# Altium project Line_Follower5.1.PrjPCB
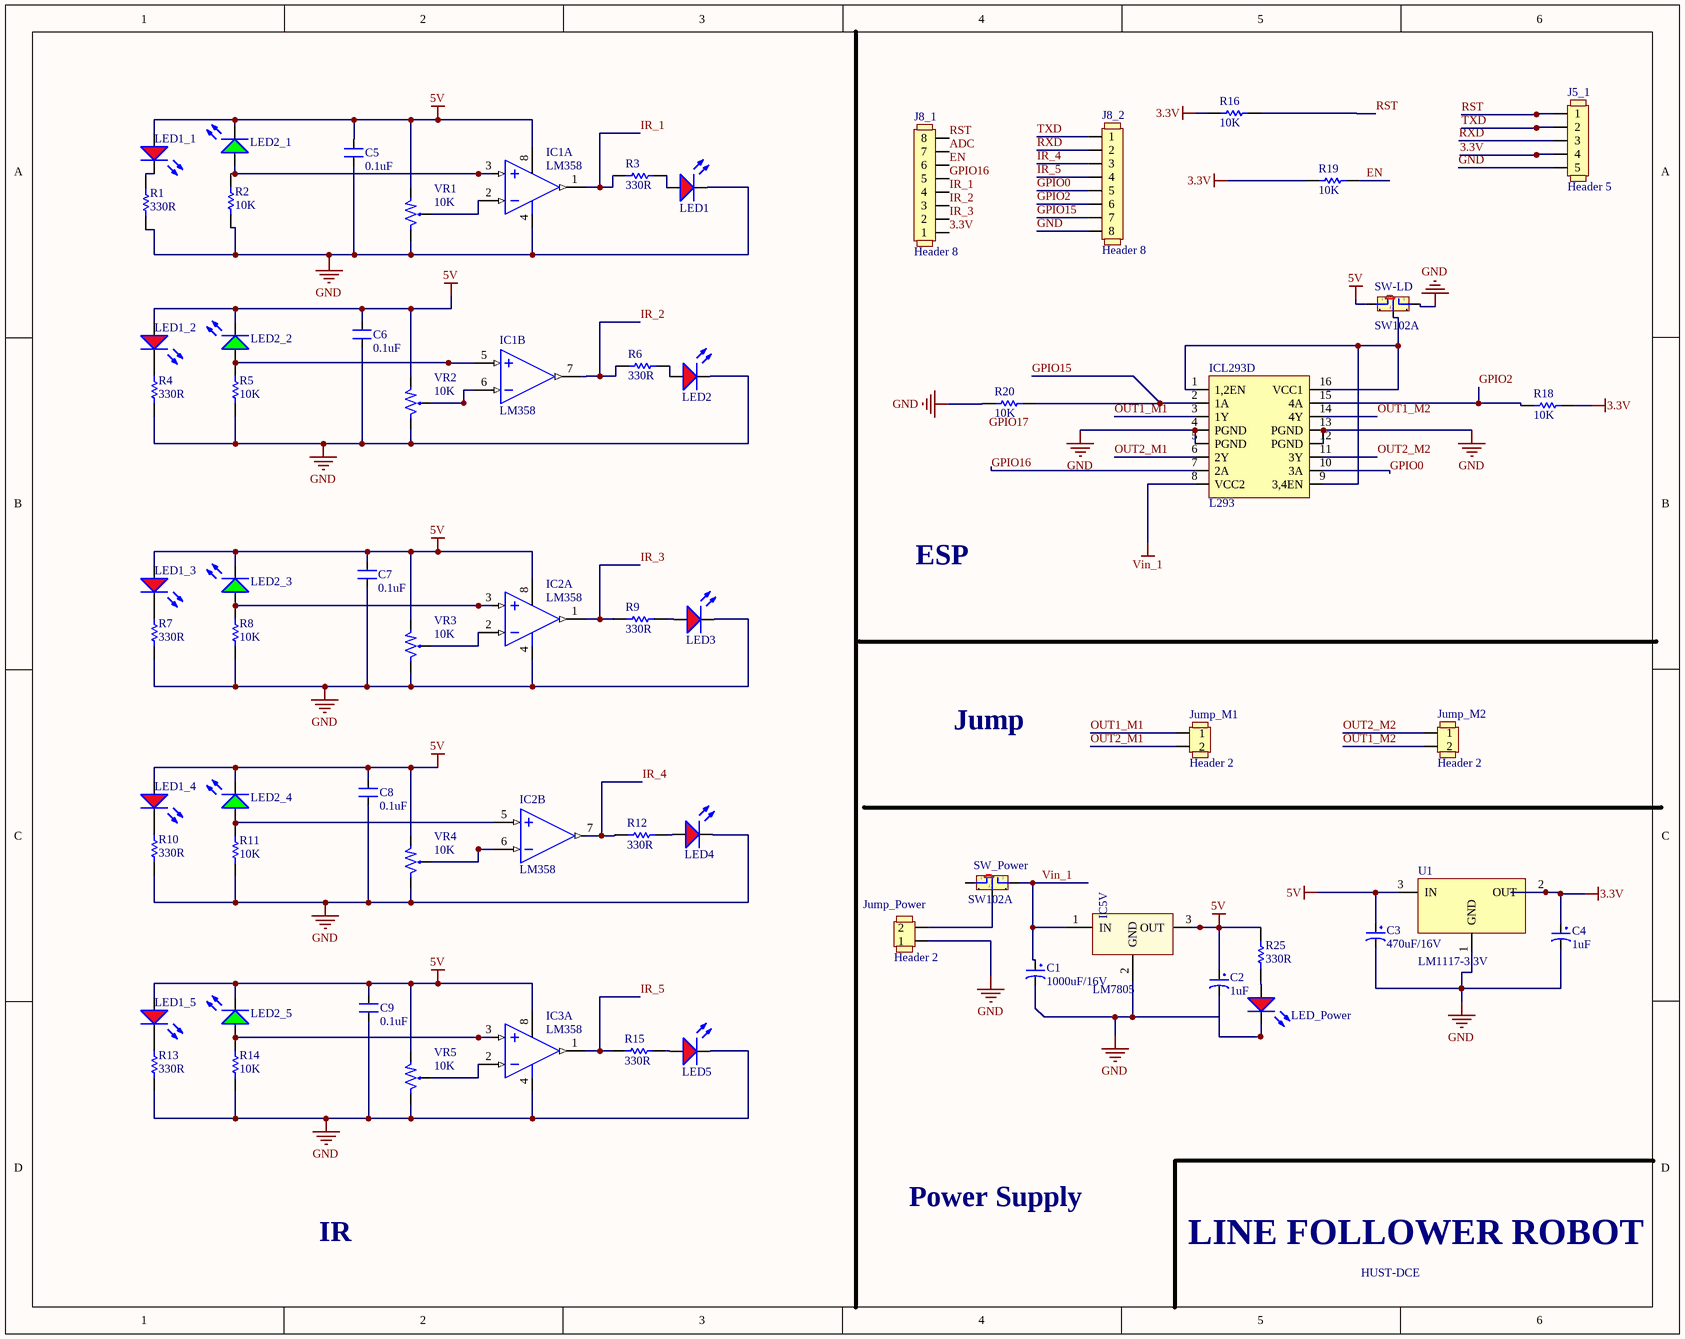
[diagram p0: Line_Follower5.1.SchDoc]
3 sheets, 78 parts. Net scope: global (net labels, ports and power ports of the same name join across sheets).
Board file: Line_Follower5.1.PcbDoc
Sheets:
  Line_Follower5.1.SchDoc
  ESP8266_base5.1.SchDoc
  ESP8266_base5.1-2.SchDoc

## Sheet Line_Follower5.1.SchDoc
size 314 x 250 mm

### Parts
(Parts that share a designator on the sheet are numbered #1, #2 ... from top to bottom, then left to right.)
C1  1000uF/16V  [CP1.5/3.4]
C2  1uF  [CAP_xUF_50V_TH_5x11]
C3  470uF/16V  [CP1.5/3.4]
C4  1uF  [CAP_xUF_50V_TH_5x11]
C5  0.1uF  [CAP_10x_TH]
C6  0.1uF  [CAP_10x_TH]
C7  0.1uF  [CAP_10x_TH]
C8  0.1uF  [CAP_10x_TH]
C9  0.1uF  [CAP_10x_TH]
IC1  LM358  [DIP8/W0.3]  (parts A,B of 2)
IC2  LM358  [DIP8/W0.3]  (parts A,B of 2)
IC3  LM358  [DIP8/W0.3]  (part A of 2)
IC5V  LM7805  [QTO-220]
ICL293D  L293  [L293]
J5_1  Header 5  [HEADER x5(2)]
J8_1  Header 8  [HEADER FEMALE x8]
J8_2  Header 8  [HEADER FEMALE x8]
Jump_M1  Header 2  [HEADER x2 (2)]
Jump_M2  Header 2  [HEADER x2 (2)]
Jump_Power  Header 2  [KF128 2P 5.08mm]
LED1  LED_RED  [LED3R3mm]  (value not drawn)
LED1_1  LED_RED  [LED5R5mm]  (value not drawn)
LED1_2  LED_RED  [LED5R5mm]  (value not drawn)
LED1_3  LED_RED  [LED5R5mm]  (value not drawn)
LED1_4  LED_RED  [LED5R5mm]  (value not drawn)
LED1_5  LED_RED  [LED5R5mm]  (value not drawn)
LED2  LED_RED  [LED3R3mm]  (value not drawn)
LED2_1  LED_GREEN  [LED3G3mm]  (value not drawn)
LED2_2  LED_GREEN  [LED3G3mm]  (value not drawn)
LED2_3  LED_GREEN  [LED3G3mm]  (value not drawn)
LED2_4  LED_GREEN  [LED3G3mm]  (value not drawn)
LED2_5  LED_GREEN  [LED3G3mm]  (value not drawn)
LED3  LED_RED  [LED3R3mm]  (value not drawn)
LED4  LED_RED  [LED3R3mm]  (value not drawn)
LED5  LED_RED  [LED3R3mm]  (value not drawn)
LED_Power  LED_RED  [LED3R3mm]  (value not drawn)
R1#1  330R  [CR25S]
R2#1  10K  [CR25S]
R3  330R  [CR25S]
R4  330R  [CR25S]
R5  10K  [CR25S]
R6  330R  [CR25S]
R7  330R  [CR25S]
R8  10K  [CR25S]
R9  330R  [CR25S]
R10  330R  [CR25S]
R11  10K  [CR25S]
R12  330R  [CR25S]
R13  330R  [CR25S]
R14  10K  [CR25S]
R15  330R  [CR25S]
R16  10K  [CR25S]
R18  10K  [CR25S]
R19  10K  [CR25S]
R20  10K  [CR25S]
R25  330R  [CR25S]
SW-LD  SW102A  [SW102]
SW_Power  SW102A  [SW102]
U1  LM1117-3.3V  [TO220-123]
VR1  10K  [Trimmer 3262]
VR2  10K  [Trimmer 3262]
VR3  10K  [Trimmer 3262]
VR4  10K  [Trimmer 3262]
VR5  10K  [Trimmer 3262]

### Nets
3.3V: C4.1 J5_1.4 J8_1.1 R16.1 R18.2 R19.1 U1.2(OUT)
5V: C2.1 C3.1 C5.2 C6.2 C7.2 C8.2 C9.2 IC1.8(+V) IC2.8(+V) IC3.8(+V) IC5V.3(OUT) LED1_1.1(A) LED1_2.1(A) LED1_3.1(A) LED1_4.1(A) LED1_5.1(A) LED2_1.2(K) LED2_2.2(K) LED2_3.2(K) LED2_4.2(K) LED2_5.2(K) R25.1 SW-LD.1 U1.3(IN) VR1.1 VR2.1 VR3.1 VR4.1 VR5.1
GND: C1.2 C2.2 C3.2 C4.2 C5.1 C6.1 C7.1 C8.1 C9.1 IC1.4(-V) IC2.4(-V) IC3.4(-V) IC5V.2(GND) ICL293D.4(PGND) ICL293D.5(PGND) ICL293D.12(PGND) ICL293D.13(PGND) J5_1.5 J8_2.8 Jump_Power.1 LED1.2(K) LED2.2(K) LED3.2(K) LED4.2(K) LED5.2(K) LED_Power.2(K) R1#1.2 R2#1.2 R4.2 R5.2 R7.2 R8.2 R10.2 R11.2 R13.2 R14.2 R20.1 SW-LD.3 U1.1(GND) VR1.3 VR2.3 VR3.3 VR4.3 VR5.3
Vin_1: C1.1 IC5V.1(IN) ICL293D.8(VCC2) SW_Power.3
ADC: J8_1.7
EN: J8_1.6 R19.2
GPIO0: ICL293D.10(3A) J8_2.5
GPIO2: ICL293D.15(4A) J8_2.6 R18.1
GPIO15: ICL293D.2(1A) J8_2.7 R20.2
GPIO16: ICL293D.7(2A) J8_1.5
IR_1: IC1.1(OUT) J8_1.4 R3.1
IR_2: IC1.7(OUT) J8_1.3 R6.1
IR_3: IC2.1(OUT) J8_1.2 R9.1
IR_4: IC2.7(OUT) J8_2.3 R12.1
IR_5: IC3.1(OUT) J8_2.4 R15.1
OUT1_M1: ICL293D.3(1Y) Jump_M1.1
OUT1_M2: ICL293D.14(4Y) Jump_M2.2
OUT2_M1: ICL293D.6(2Y) Jump_M1.2
OUT2_M2: ICL293D.11(3Y) Jump_M2.1
RST: J5_1.1 J8_1.8 R16.2
RXD: J5_1.3 J8_2.2
TXD: J5_1.2 J8_2.1
NetIC1_2: IC1.2(IN-) VR1.2
NetIC1_3: IC1.3(IN+) LED2_1.1(A) R2#1.1
NetIC1_5: IC1.5(IN+) LED2_2.1(A) R5.1
NetIC1_6: IC1.6(IN-) VR2.2
NetIC2_2: IC2.2(IN-) VR3.2
NetIC2_3: IC2.3(IN+) LED2_3.1(A) R8.1
NetIC2_5: IC2.5(IN+) LED2_4.1(A) R11.1
NetIC2_6: IC2.6(IN-) VR4.2
NetIC3_2: IC3.2(IN-) VR5.2
NetIC3_3: IC3.3(IN+) LED2_5.1(A) R14.1
NetICL293D_1: ICL293D.1(1,2EN) ICL293D.9(3,4EN) ICL293D.16(VCC1) SW-LD.2
NetJump_Power_2: Jump_Power.2 SW_Power.2
NetLED1_1: LED1.1(A) R3.2
NetLED1_1_2: LED1_1.2(K) R1#1.1
NetLED1_2_2: LED1_2.2(K) R4.1
NetLED1_3_2: LED1_3.2(K) R7.1
NetLED1_4_2: LED1_4.2(K) R10.1
NetLED1_5_2: LED1_5.2(K) R13.1
NetLED2_1: LED2.1(A) R6.2
NetLED3_1: LED3.1(A) R9.2
NetLED4_1: LED4.1(A) R12.2
NetLED5_1: LED5.1(A) R15.2
NetLED_Power_1: LED_Power.1(A) R25.2

Not connected (* = marked no-connect by the designer): SW-LD 4 5; SW_Power 1 4 5

### Notes on the sheet
- ESP
- Jump
- Power Supply
- IR
- LINE FOLLOWER ROBOT
- HUST-DCE
- Labels drawn without touching a wire or pin: GPIO17

### Library data of the parts
C1 C3 = CP4: Cap 1000uF/16V - 220uF/50V; Description 5: 4,7uF>10uF/250V_3,3uF>10uF/400V - 2,2uF>4,7uF/450V; Description 1: 2200uF-3300uF/6,3V - 1000uF-2200uF/10V; Description 2: 1000uF/16V - 470uF => 1000uF/25V - 100uF/100V; Description 3: 330uF>470uF/35V_220uF>470uF/50V_10uF>22uF/250V; Description 4: 220uF => 330uF/63V - 10uF =>33uF/160 - 200V; Value: 1000uF/16V
C2 C4 = CAP_ALU/CHE_0.1uF_50V_POL_5x11: Use for 0.1/0.22/0.33/0.47/1/2.2/3.3/4.7/10/22 uF Capacitor Through Hole
C5-C9 = CAP_CER_0.1uF_50V_NPOL_1: Ceramic Capacitor 1nF/50V (+-20% TH)/(+10%SMD)
IC1-IC3 = LM358: Low-Power Dual Operational Amplifier; Value: LM358
IC5V = LM78xx: On ap +, from + 5 to + 24VDC; Value: LM7805
LED1 LED1_1-LED1_5 LED2-LED5 LED_Power = LED_RED: LED Red; ComponentLink1Description: Datasheet; ComponentLink1URL: D:\Dropbox\Datasheets\Opto and Illumination\LEDs\SMD LED.pdf; Unit Price: 0.0476; Value: Red
LED2_1-LED2_5 = LED_GREEN: LED Green; ComponentLink1Description: Datasheet; ComponentLink1URL: D:\Dropbox\Datasheets\Opto and Illumination\LEDs\SMD LED.pdf; Unit Price: 0.0476; Value: Green
R1#1 R2#1 R3-R16 R18-R20 R25 = Resistor 1/4W: Resistor through hole 1/4W
SW-LD SW_Power = SW102A: Switch 102 on Broad; Value: Switch 102 On Board
U1 = LM1117: 800mA Low-Dropout Linear Regulator; Creator: Nguyen Ba Bien; Website: http://group3i.net
VR1-VR5 = Variable Resistor: WH148

## Sheet ESP8266_base5.1.SchDoc
size A
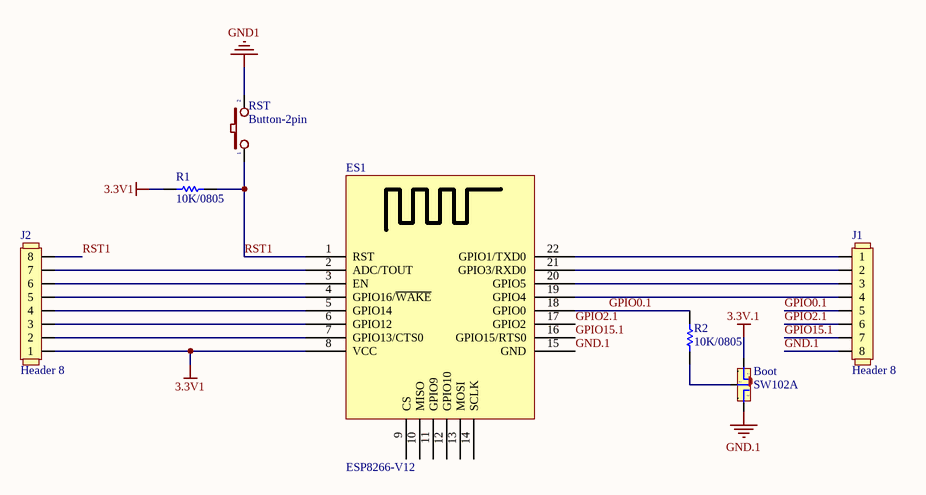
[diagram p1: ESP8266_base5.1.SchDoc]

### Parts
(Parts that share a designator on the sheet are numbered #1, #2 ... from top to bottom, then left to right.)
Boot  SW102A  [SW102]
ES1  ESP8266-V12  [ESP-8266 V12]
J1  Header 8  [HEADER x8]
J2  Header 8  [HEADER x8]
R1#2  10K/0805  [Res 0805(2012)]
R2#2  10K/0805  [Res 0805(2012)]
RST  Button-2pin  [BUTTON_2P_SMD]

### Nets
3.3V1: ES1.8(VCC) J2.1 R1#2.2
3.3V.1: Boot.1
GND1: RST.2
GND.1: Boot.3 ES1.15(GND) J1.8
GPIO0.1: ES1.18(GPIO0) J1.5 R2#2.1
GPIO2.1: ES1.17(GPIO2) J1.6
GPIO15.1: ES1.16(GPIO15/RTS0) J1.7
RST1: ES1.1(RST) J2.8 R1#2.1 RST.1
NetBoot_2: Boot.2 R2#2.2
NetES1_2: ES1.2(ADC/TOUT) J2.7
NetES1_3: ES1.3(EN) J2.6
NetES1_4: ES1.4(GPIO16/~{WAKE}) J2.5
NetES1_5: ES1.5(GPIO14) J2.4
NetES1_6: ES1.6(GPIO12) J2.3
NetES1_7: ES1.7(GPIO13/CTS0) J2.2
NetES1_19: ES1.19(GPIO4) J1.4
NetES1_20: ES1.20(GPIO5) J1.3
NetES1_21: ES1.21(GPIO3/RXD0) J1.2
NetES1_22: ES1.22(GPIO1/TXD0) J1.1

Not connected (* = marked no-connect by the designer): Boot 4 5; ES1 9(CS) 10(MISO) 11(GPIO9) 12(GPIO10) 13(MOSI) 14(SCLK)

### Library data of the parts
Boot = SW102A: as SW-LD on sheet Line_Follower5.1
R1#2 R2#2 = Resistor 0805

## Sheet ESP8266_base5.1-2.SchDoc
size A
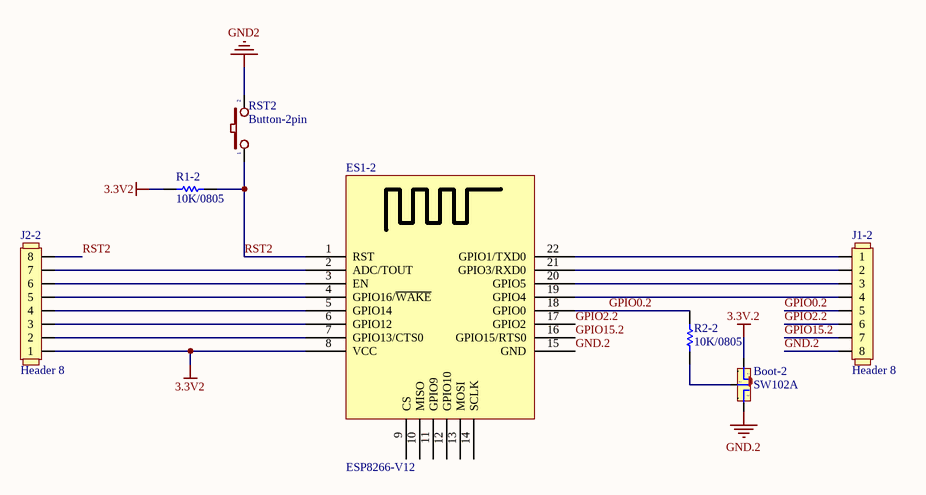
[diagram p2: ESP8266_base5.1-2.SchDoc]

### Parts
Boot-2  SW102A  [SW102]
ES1-2  ESP8266-V12  [ESP-8266 V12]
J1-2  Header 8  [HEADER x8]
J2-2  Header 8  [HEADER x8]
R1-2  10K/0805  [Res 0805(2012)]
R2-2  10K/0805  [Res 0805(2012)]
RST2  Button-2pin  [BUTTON_2P_SMD]

### Nets
3.3V2: ES1-2.8(VCC) J2-2.1 R1-2.2
3.3V.2: Boot-2.1
GND2: RST2.2
GND.2: Boot-2.3 ES1-2.15(GND) J1-2.8
GPIO0.2: ES1-2.18(GPIO0) J1-2.5 R2-2.1
GPIO2.2: ES1-2.17(GPIO2) J1-2.6
GPIO15.2: ES1-2.16(GPIO15/RTS0) J1-2.7
RST2: ES1-2.1(RST) J2-2.8 R1-2.1 RST2.1
NetBoot-2_2: Boot-2.2 R2-2.2
NetES1-2_2: ES1-2.2(ADC/TOUT) J2-2.7
NetES1-2_3: ES1-2.3(EN) J2-2.6
NetES1-2_4: ES1-2.4(GPIO16/~{WAKE}) J2-2.5
NetES1-2_5: ES1-2.5(GPIO14) J2-2.4
NetES1-2_6: ES1-2.6(GPIO12) J2-2.3
NetES1-2_7: ES1-2.7(GPIO13/CTS0) J2-2.2
NetES1-2_19: ES1-2.19(GPIO4) J1-2.4
NetES1-2_20: ES1-2.20(GPIO5) J1-2.3
NetES1-2_21: ES1-2.21(GPIO3/RXD0) J1-2.2
NetES1-2_22: ES1-2.22(GPIO1/TXD0) J1-2.1

Not connected (* = marked no-connect by the designer): Boot-2 4 5; ES1-2 9(CS) 10(MISO) 11(GPIO9) 12(GPIO10) 13(MOSI) 14(SCLK)

### Library data of the parts
Boot-2 = SW102A: as SW-LD on sheet Line_Follower5.1
R1-2 R2-2 = Resistor 0805